# Altium schematic sheet Analog_Front_End.SchDoc
size B; Organization: Mechanart, LLC; Address1: 397 Laurie Meadows Drive; Address2: Apt. 437; Address3: San Mateo, CA 94403
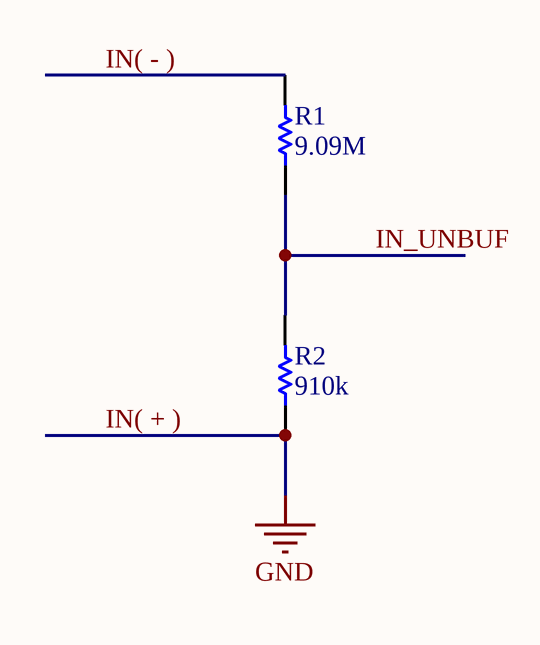
[diagram p0: Analog_Front_End.SchDoc]

## Parts
R1  9.09M  [RESC_0603[0201]_N]
R2  910k  [RESC_0603[0201]_N]

## Nets
IN( + ): R2.1  [also labelled GND]
IN( - ): R1.2
IN_UNBUF: R1.1 R2.2

## Notes on the sheet
- Title
- Size:
- Date:
- B
- Number:
- Time:
- Revision:
- Sheet
- of
- File:

## Library data of the parts
R1 = CRCW06039M09FKEA: RES SMD 9.09M OHM 1% 1/10W 0603; Manufacturer: Vishay Dale; Power (Watts): 0.1W, 1/10W; Temperature Coefficient: ±100ppm/°C; Design Item Id: CRCW06039M09FKEA; Resistance: 9.09M; Supplier 1: Digi-Key; Supplier Part Number 1: 541-9.09MHCT-ND; Manufacturer Part Number: CRCW06039M09FKEA; RoHS: RoHS Compliant; Category: Resistors; Stock 1: 67332; Pricing 1: 10=0.081, 50=0.0436, 200=0.0251, 1000=0.01711 (USD); Packaging: Cut Tape (CT); Operating Temperature: -55°C ~ 155°C; Package / Case: 0603 (1608 Metric); Supplier Device Package: 0603 (1608 Metric); ComponentLink1URL: http://www.vishay.com/docs/20035/dcrcwe3.pdf; ComponentLink1Description: http://www.vishay.com/docs/20035/dcrcwe3.pdf; Tolerance: ±1%; Composition: Thick Film; Features: Automotive AEC-Q200; Size / Dimension: 0.061" L x 0.033" W (1.55mm x 0.85mm); Height: 0.020" (0.50mm); Number of Terminations: 2
R2 = CRCW0603910KFKEA: RES SMD 910K OHM 1% 1/10W 0603; Manufacturer: Vishay Dale; Power (Watts): 0.1W, 1/10W; Temperature Coefficient: ±100ppm/°C; Design Item Id: CRCW0603910KFKEA; Resistance: 910k; Supplier 1: Digi-Key; Supplier Part Number 1: 541-910KHCT-ND; Manufacturer Part Number: CRCW0603910KFKEA; RoHS: RoHS Compliant; Category: Resistors; Stock 1: 12023; Pricing 1: 10=0.081, 50=0.0436, 200=0.0251, 1000=0.01711 (USD); Packaging: Cut Tape (CT); Operating Temperature: -55°C ~ 155°C; Package / Case: 0603 (1608 Metric); Supplier Device Package: 0603 (1608 Metric); ComponentLink1URL: http://www.vishay.com/docs/20035/dcrcwe3.pdf; ComponentLink1Description: http://www.vishay.com/docs/20035/dcrcwe3.pdf; Tolerance: ±1%; Composition: Thick Film; Features: Automotive AEC-Q200; Size / Dimension: 0.061" L x 0.033" W (1.55mm x 0.85mm); Height: 0.020" (0.50mm); Number of Terminations: 2